# Altium schematic sheet connector.SchDoc
size A4
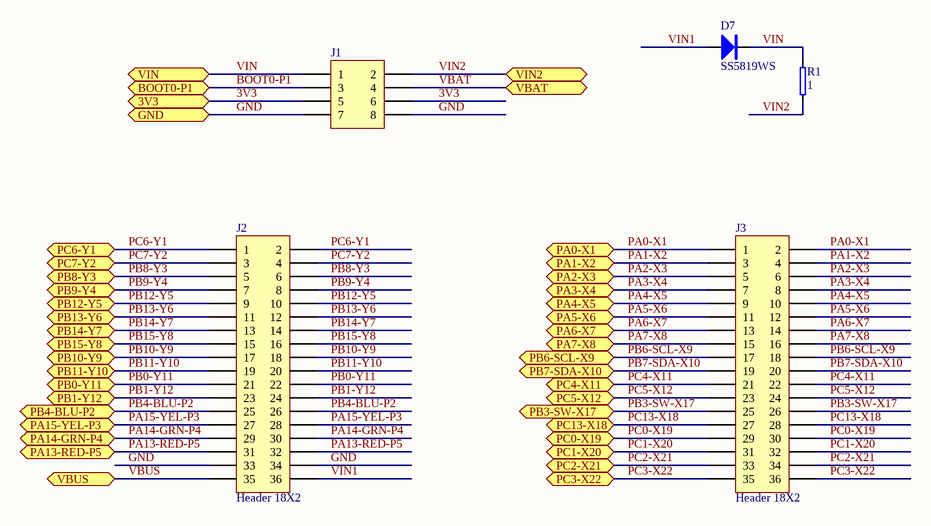
[diagram p0: connector.SchDoc]

## Parts
D7  SS5819WS  [1N5819-SOD323]
J1  (no value)  [HDR2X4]
J2  Header 18X2  [HDR2X18]
J3  Header 18X2  [HDR2X18]
R1  1  [SMD0402]

## Ports
3V3, BOOT0-P1, GND, PA0-X1, PA1-X2, PA2-X3, PA3-X4, PA4-X5, PA5-X6, PA6-X7, PA7-X8, PA13-RED-P5, PA14-GRN-P4, PA15-YEL-P3, PB0-Y11, PB1-Y12, PB3-SW-X17, PB4-BLU-P2, PB6-SCL-X9, PB7-SDA-X10, PB8-Y3, PB9-Y4, PB10-Y9, PB11-Y10, PB12-Y5, PB13-Y6, PB14-Y7, PB15-Y8, PC0-X19, PC1-X20, PC2-X21, PC3-X22, PC4-X11, PC5-X12, PC6-Y1, PC7-Y2, PC13-X18, VBAT, VBUS, VIN, VIN2

## Nets
3V3: J1.5 J1.6 ; port 3V3
BOOT0-P1: J1.3 ; port BOOT0-P1
GND: J1.7 J1.8 J2.33 J2.34 ; port GND
PA0-X1: J3.1 J3.2 ; port PA0-X1
PA1-X2: J3.3 J3.4 ; port PA1-X2
PA2-X3: J3.5 J3.6 ; port PA2-X3
PA3-X4: J3.7 J3.8 ; port PA3-X4
PA4-X5: J3.9 J3.10 ; port PA4-X5
PA5-X6: J3.11 J3.12 ; port PA5-X6
PA6-X7: J3.13 J3.14 ; port PA6-X7
PA7-X8: J3.15 J3.16 ; port PA7-X8
PA13-RED-P5: J2.31 J2.32 ; port PA13-RED-P5
PA14-GRN-P4: J2.29 J2.30 ; port PA14-GRN-P4
PA15-YEL-P3: J2.27 J2.28 ; port PA15-YEL-P3
PB0-Y11: J2.21 J2.22 ; port PB0-Y11
PB1-Y12: J2.23 J2.24 ; port PB1-Y12
PB3-SW-X17: J3.25 J3.26 ; port PB3-SW-X17
PB4-BLU-P2: J2.25 J2.26 ; port PB4-BLU-P2
PB6-SCL-X9: J3.17 J3.18 ; port PB6-SCL-X9
PB7-SDA-X10: J3.19 J3.20 ; port PB7-SDA-X10
PB8-Y3: J2.5 J2.6 ; port PB8-Y3
PB9-Y4: J2.7 J2.8 ; port PB9-Y4
PB10-Y9: J2.17 J2.18 ; port PB10-Y9
PB11-Y10: J2.19 J2.20 ; port PB11-Y10
PB12-Y5: J2.9 J2.10 ; port PB12-Y5
PB13-Y6: J2.11 J2.12 ; port PB13-Y6
PB14-Y7: J2.13 J2.14 ; port PB14-Y7
PB15-Y8: J2.15 J2.16 ; port PB15-Y8
PC0-X19: J3.29 J3.30 ; port PC0-X19
PC1-X20: J3.31 J3.32 ; port PC1-X20
PC2-X21: J3.33 J3.34 ; port PC2-X21
PC3-X22: J3.35 J3.36 ; port PC3-X22
PC4-X11: J3.21 J3.22 ; port PC4-X11
PC5-X12: J3.23 J3.24 ; port PC5-X12
PC6-Y1: J2.1 J2.2 ; port PC6-Y1
PC7-Y2: J2.3 J2.4 ; port PC7-Y2
PC13-X18: J3.27 J3.28 ; port PC13-X18
VBAT: J1.4 ; port VBAT
VBUS: J2.35 ; port VBUS
VIN: D7.2 J1.1 R1.1 ; port VIN
VIN1: D7.1 J2.36
VIN2: J1.2 R1.2 ; port VIN2

## Library data of the parts
D7 = Diode
J1 = Header 4X2: Header, 4-Pin, Dual row; LatestRevisionDate: 17-Jul-2002; LatestRevisionNote: Re-released for DXP Platform.; Publisher: Altium Limited
J2 J3 = Header 18X2: Header, 18-Pin, Dual row; LatestRevisionDate: 17-Jul-2002; LatestRevisionNote: Re-released for DXP Platform.; Publisher: Altium Limited
R1 = Res